# EAGLE design Grove - LED String Light (EAGLE 6.4)
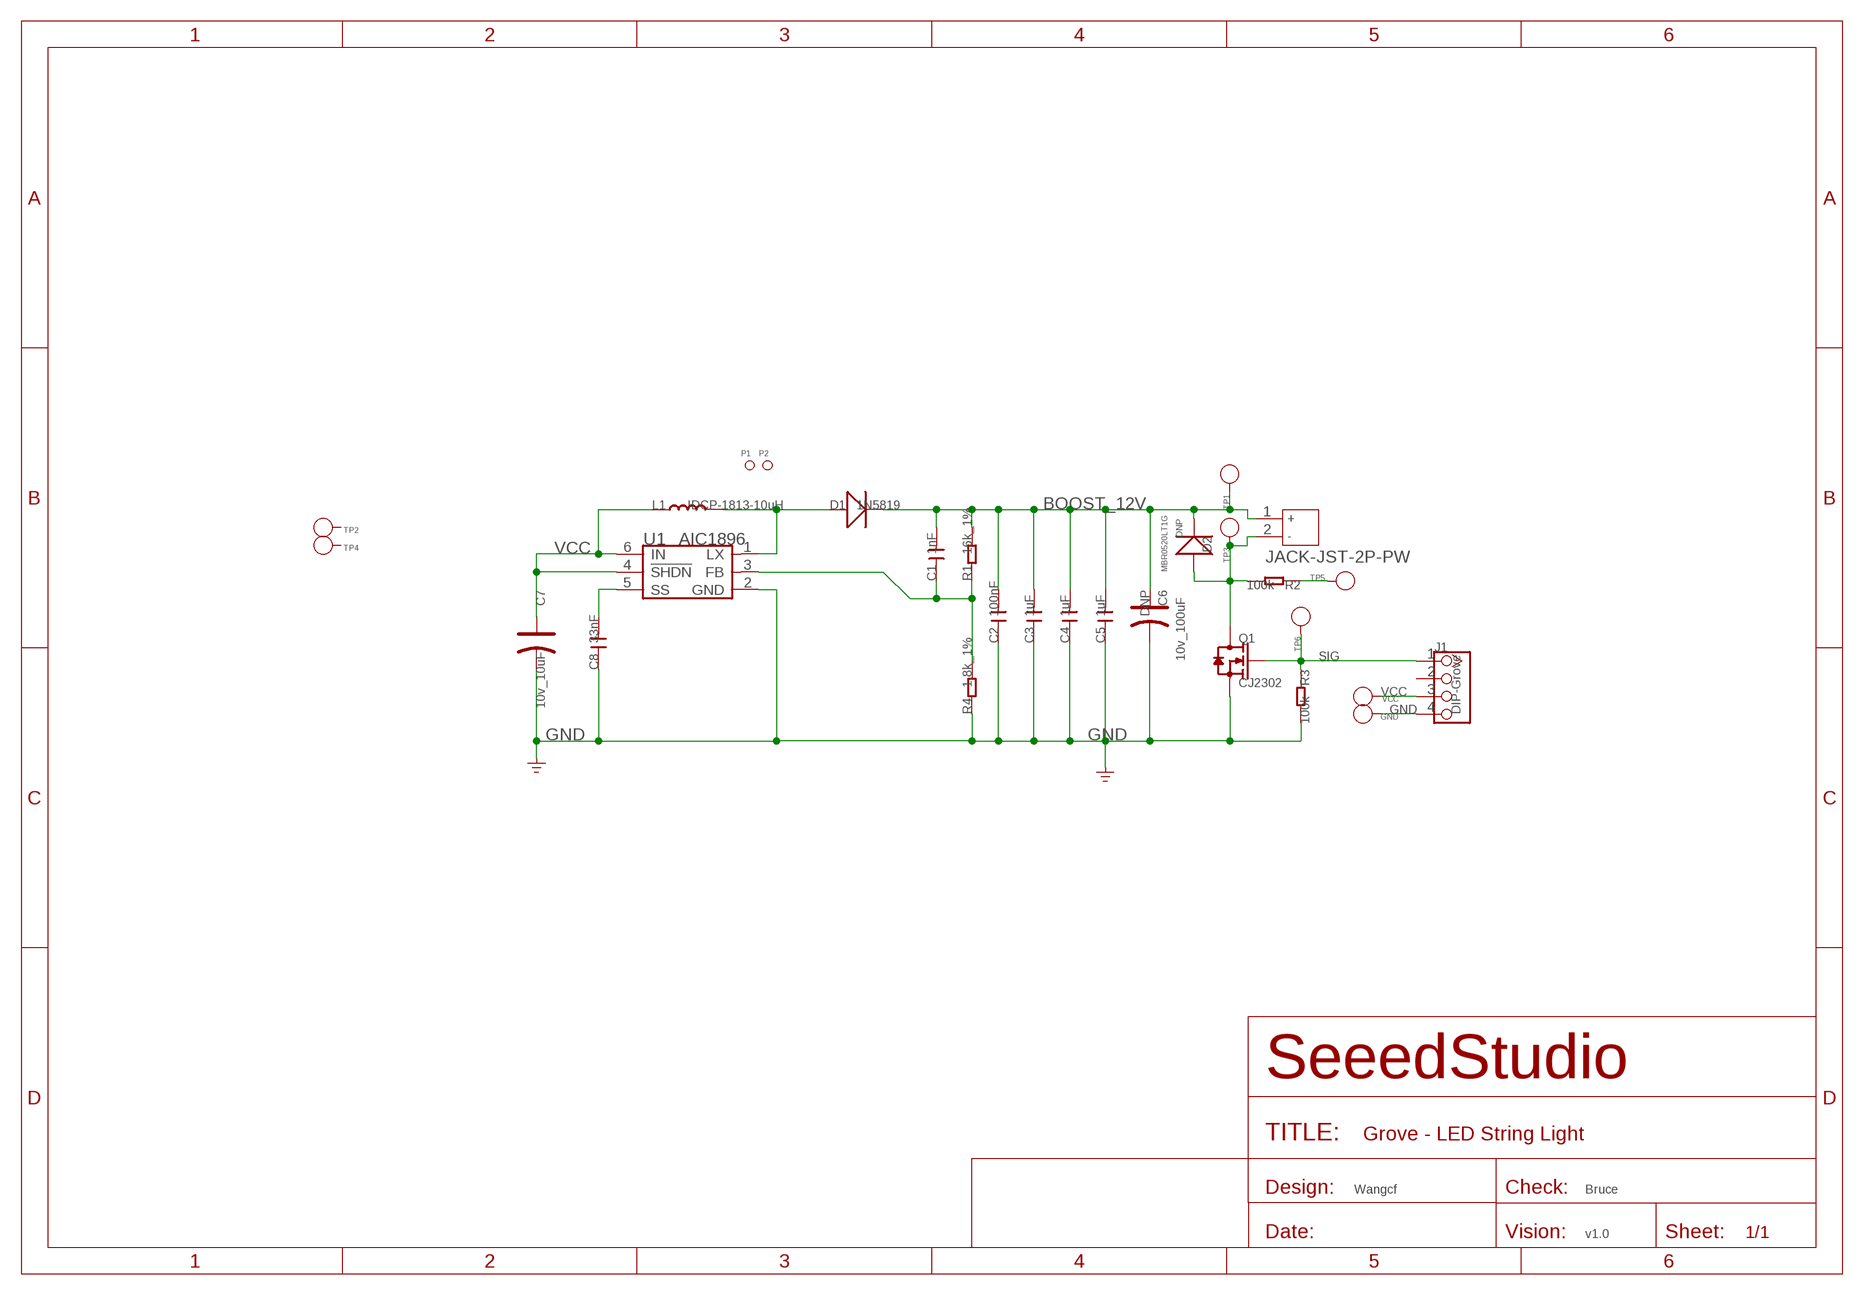
[diagram p0: schematic, sheet 1]

## Parts
C1  1nF  C-0603  [C0603]
C2  100nF  C-0603  [C0603]
C3  1uF  C-0603  [C0603]
C4  1uF  C-0603  [C0603]
C5  1uF  C-0603  [C0603]
C6  DNP  006-CAP_AVX_C  [AVX_C]
C7  10v_10uF  CAP-AVX-A  [AVX-A]
C8  33nF  C-0603  [C0603]
D1  1N5819  D'SMA'  [D2010]
D2  DNP  D'1206'  [SOD123]
GND  PAD-TEST-POINT'4545'  [TP_4545]
J1  DIP-Grove  TWIG-4P-2.0-2.0  [4P-2.0]
J3  JACK-JST-2P-PW  JACK-JST-2P-PW'2.0'  [JST-2.0]
L1  IDCP-1813-10uH  013-L1813  [1813@1]
P1  PAD-MARK  [ROUND-MARK-1.0]
P2  PAD-MARK  [ROUND-MARK-1.0]
Q1  CJ2302  MOSFET-N'SOT23'  [SOT23]
R1  16k_1%  R-0603  [R0603]
R2  100k  R-0603  [R0603]
R3  100k  R-0603  [R0603]
R4  1.8k_1%  R-0603  [R0603]
TP1  PAD-TEST-POINT'4545'  [TP_4545]
TP2  PAD-TEST-POINT'4545'  [TP_4545]
TP3  PAD-TEST-POINT'4545'  [TP_4545]
TP4  PAD-TEST-POINT'4545'  [TP_4545]
TP5  PAD-TEST-POINT'4545'  [TP_4545]
TP6  PAD-TEST-POINT'4545'  [TP_4545]
U1  AIC1896  [SOT23-6]
VCC  PAD-TEST-POINT'4545'  [TP_4545]

## Nets
BOOST_12V: C1.2 C2.2 C3.2 C4.2 C5.2 C6.+ D1.- D2.- J3.1 R1.2 TP1.T
GND: C2.1 C3.1 C4.1 C5.1 C6.- C7.- C8.1 GND.T J1.4 Q1.2(S) R3.2 R4.1 U1.2(GND)
N$1: D2.+ J3.2 Q1.3(D) R2.2 TP3.T
N$2: R2.1 TP5.T
N$35: C8.2 U1.5(SS)
N$36: D1.+ L1.2 U1.1(LX)
N$37: C1.1 R1.1 R4.2 U1.3(FB)
SIG: J1.1 Q1.1(G) R3.1 TP6.T
VCC: C7.+ J1.3 L1.1 U1.4(!SHDN) U1.6(IN) VCC.T
Unconnected: J1.2 TP2.T TP4.T

## Notes on the sheet
- MBR0520LT1G
- 10v_100uF
- Wangcf | Bruce
- v1.0

## Library data of the parts
C1-C5 C8 = Discrete:C*: Ceramic Capacitors
C6 = Discrete:006-CAP*: Electrolytic Capacitors,Tantalum Capacitors and Super Capacitors
C7 = Discrete:CAP*: Electrolytic Capacitors,Tantalum Capacitors and Super Capacitors
D1 D2 = Discrete:D*
GND TP1-TP6 VCC = Discrete:PAD-TEST-POINT; PARTNO: DNP
J1 = Connector :TWIG-4P-2.0
J3 = Connector:JACK-JST-2P-PW
L1 = Discrete:013-L*
P1 P2 = Discrete:PAD-MARK; PARTNO: DNP
Q1 = Discrete:MOSFET-N: IRLL014: http://www.vishay.com/docs/91319/sihll014.pdf
R1-R4 = Discrete:R*
U1 = ICs_v54:AIC1896

## Net classes
0 default: width 0.152 mm, drill 0.305 mm, clearance 0.152 mm
3 none3: width 0.203 mm, drill 0.305 mm, clearance 0.203 mm

## Board
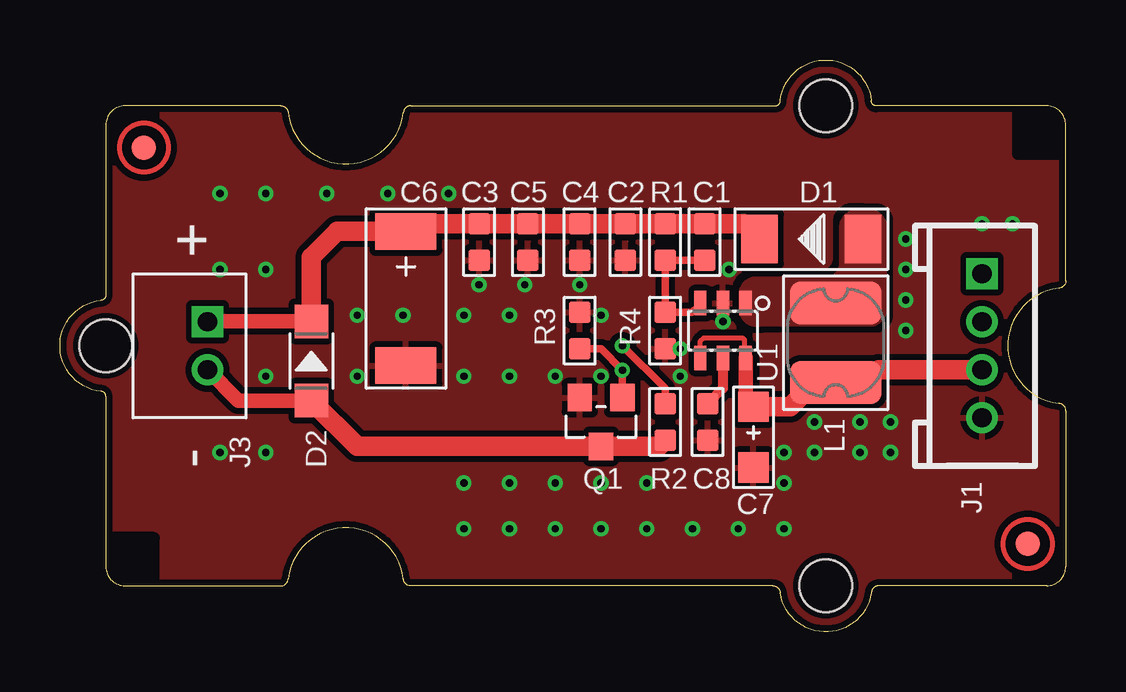
[diagram p1: board, top side]
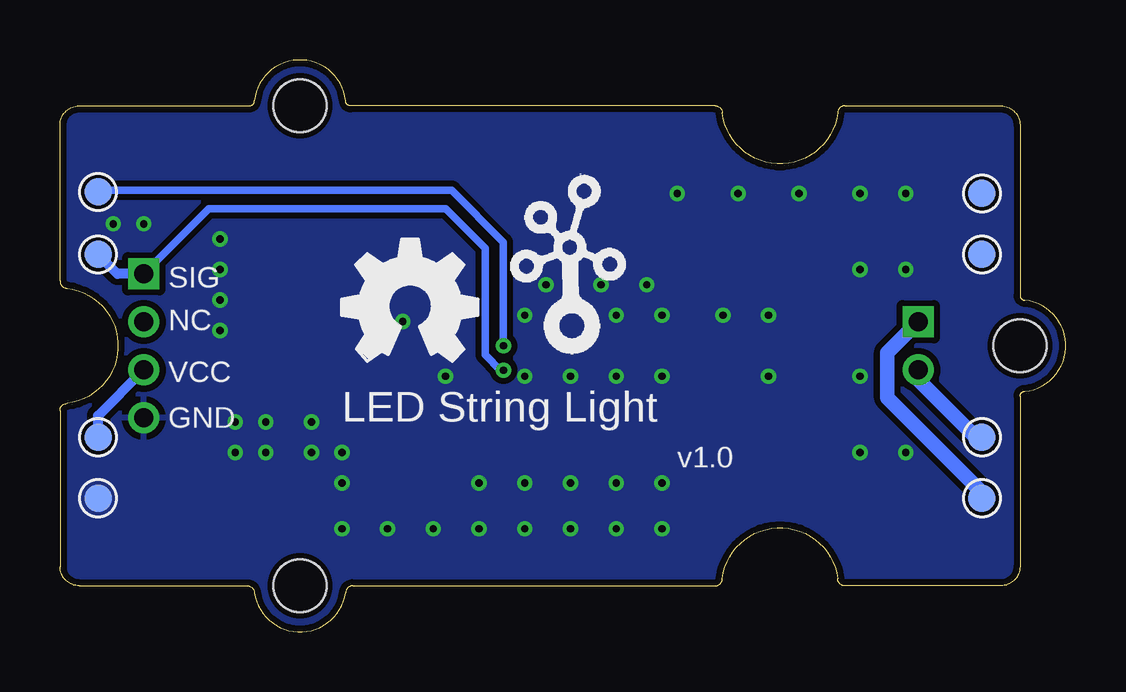
[diagram p2: board, bottom side, seen from below]

Size 41.91 x 23.83 mm. Coordinates in mm from the lower left corner, seen from the top.
Copper layers (1*2+15*16): Top 0.035mm / dielectric 0.2mm / Route2 0.0175mm / dielectric 0.4mm / Route15 0.0175mm / dielectric 0.2mm / Bottom 0.035mm
Design rules "default *": minimum track width 6mil, minimum drill 12mil, track to track 6mil, track to pad 6mil, pad to pad 6mil, via to via 6mil, smd to smd 0mil, copper to edge 10mil, drill to drill 10mil, minimum pad ring 10mil, minimum via ring 6mil, stop-mask expansion 2mil, vias tented up to drill 100mil, thermal gap 10mil

### Footprints (pad centres in the part's own frame; a part is rotated, then mirrored left to right if it is on the bottom)
C0603 = smd 0.889 x 0.889: 1 -0.762,0; 2 0.762,0
AVX_C = smd 1.524 x 2.54: + -2.794,0; - 2.794,0
AVX-A = smd 1.27 x 1.27: + -1.27,0; - 1.27,0
D2010 = smd 1.524 x 2.032: + -2.159,0; - 2.159,0
SOD123 = smd 1.397 x 1.397: + -1.651,0; - 1.651,0
TP_4545 = smd 1.143 x 1.143: T 0,0
4P-2.0 = drill 0.8 pad 1.27 square: 1 -3,0 | drill 0.8 pad 1.27: 2 -1,0; 3 1,0; 4 3,0
JST-2.0 = drill 0.8 pad 1.3 square: 1 -1,0.75 | drill 0.8 pad 1.3: 2 1,0.75
1813@1 = smd 1.778 x 3.81: 1 -1.651,0; 2 1.651,0
ROUND-MARK-1.0 = smd 1.016 x 1.016: P$1 0,0
SOT23 = smd 1.016 x 1.143: 1 -0.889,-1.016; 2 0.889,-1.016; 3 0,1.016
R0603 = smd 0.889 x 0.889: 1 -0.762,0; 2 0.762,0
SOT23-6 = smd 0.508 x 1.016: 1 -0.94,-1.143; 2 0,-1.143; 3 0.94,-1.143; 4 0.94,1.143; 5 0,1.143; 6 -0.94,1.143
GROVE-2CONNECTOR = hole 2.2: -10,-10; -10,10; 20,0

### Placement (x,y rotation side)
C1  26.86,16.24 90 top
C2  23.56,16.24 90 top
C3  17.46,16.24 90 top
C4  21.65,16.24 90 top
C5  19.5,16.24 90 top
C6  14.42,13.89 270 top
C7  28.89,8.11 270 top
C8  26.99,8.75 90 top
D1  31.31,16.37 180 top
D2  10.48,11.29 90 top
GND  40.32,5.57 180 bottom
J1  38.42,11.92 270 top
J3  5.4,11.92 270 top
L1  32.32,12.05 90 top
P1  40.32,3.67 180 top
P2  3.49,20.18 180 top
Q1  22.54,8.75 180 top
R1  25.21,16.24 90 top
R2  25.21,8.75 270 top
R3  21.65,12.56 90 top
R4  25.21,12.56 90 top
TP1  3.49,5.57 180 bottom
TP2  3.49,15.73 180 bottom
TP3  3.49,8.11 180 bottom
TP4  3.49,18.27 180 bottom
TP5  40.32,18.33 180 bottom
TP6  40.32,15.73 180 bottom
U1  27.62,12.56 180 top
U$4  [OSHW_FILLX200_NOTEXT]  30.16,11.29 0 bottom
U$5  [GROVE-2CONNECTOR]  21.91,11.92 180 top
U$6  [TWIGLOGO]  20.64,12.56 0 bottom
VCC  40.32,8.11 180 bottom

### Tracks (layer width: path | path; a pad name or v marks a point on that pad's centre or on a via)
BOOST_12V
  Top 0.61: D2.- 6.16,12.94 J3.1
  Top 0.813: C5.2 C4.2 | C4.2 C3.2 14.42,17 C6.+ | D2.- 10.48,15.6 11.56,16.68 C6.+ | 14.48,16.62 C6.+ | C4.2 C2.2 R1.2 26.73,17 C1.2 28.51,17 D1.-
  Bottom 0.61: TP1.T 3.49,5.83 7.43,9.76 7.43,11.64 J3.1
GND  (via drill 0.3 pad 0.64)
  other vias: 34.61,8.75 33.34,8.75 31.43,8.75 22.54,6.21 20.64,6.21 18.73,6.21 24.45,6.21 30.16,6.21 30.16,7.48 16.83,6.21 20.64,10.65 18.73,10.65 16.83,10.65 16.19,18.27 35.24,12.56 35.24,13.83 35.24,15.1 35.24,16.37 38.42,17 39.69,17 31.43,7.48 33.34,7.48 34.61,7.48 8.57,7.48 6.67,7.48 6.67,15.1 6.67,18.27 8.57,10.65 8.57,15.1 13.65,18.27 11.11,18.27 8.57,18.27 18.73,4.3 20.64,4.3 22.54,4.3 24.45,4.3 28.26,4.3 26.35,4.3 30.16,4.3 17.46,14.46 16.83,4.3 27.62,12.94 25.85,10.65 19.37,14.46 18.73,13.19 16.83,13.19 22.54,13.19 22.54,10.65 12.38,13.19 12.38,10.65 25.85,11.79 27.88,15.1 21.65,14.46 14.29,13.19
  pour Top (isolate 0.254, rank 6): 42.23,-0.14 -0.32,-0.14 -0.32,23.99 42.23,23.99
  pour Bottom (isolate 0.254): 42.23,-0.14 -0.32,-0.14 -0.32,23.99 42.23,23.99
N$1
  Top 0.61: D2.+ 7.43,9.64 J3.2
  Top 0.813: R2.2 24.96,7.73 Q1.3 12.38,7.73 D2.+
  Bottom 0.61: TP3.T 3.75,8.11 6.16,10.52 6.16,10.91 J3.2
N$2  (via drill 0.3 pad 0.64)
  Top 0.305: R2.1 25.21,10.14 v23.43,11.92
  Bottom 0.305: 40.32,18.14 TP5.T 40.26,18.4 25.59,18.4 23.43,16.24 v23.43,11.92
N$35
  Top 0.406: U1.5 27.62,10.14 C8.2
N$36
  pour Top (isolate 0.254, no thermals): 32.58,15.35 32.58,16.87 arc-90 33.21,17.51 33.72,17.51 arc-90 34.35,16.87 34.35,13.45 arc-90 33.72,12.81 29.02,12.81 arc-90 28.39,13.45 28.39,14.08 arc-90 29.02,14.72 31.94,14.72 arc90
N$37
  Top 0.305: U1.3 26.61,13.62 26.61,13.57 26.35,13.32 R4.2 R1.1 C1.1
SIG  (via drill 0.3 pad 0.64)
  Top 0.305: Q1.1 v23.43,10.91 22.54,11.79 R3.1
  Bottom 0.305: v23.43,10.91 23.56,10.91 24.19,11.54 24.19,15.99 25.85,17.64 35.7,17.64 J1.1
  Bottom 0.406: J1.1 39.51,14.92 TP6.T
VCC
  Top 0.203: U1.4 26.68,12.12 26.82,12.26 28.43,12.26 28.51,12.18 28.51,11.46 U1.6
  Top 0.61: U1.6 28.56,9.71 C7.+
  Top 0.813: J1.3 34.12,10.92 33.59,10.4 L1.1 31.43,10.4 30.42,9.38 C7.+
  Bottom 0.406: VCC.T 40.32,9.02 J1.3

### Text on the board
tPlace: + | -
bPlace: SIG | NC | VCC | LED String Light | GND | v1.0